# Altium schematic sheet Soft.SchDoc
size A4; SheetNumber: 4; SheetTotal: 4
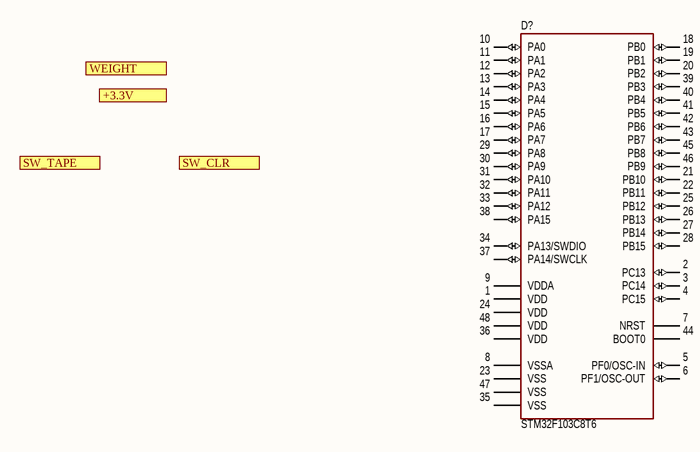
[diagram p0: Soft.SchDoc]

## Parts
D?  (no value)  [48-LQFP]

## Ports
+3.3V (out), SW_CLR (out), SW_TAPE (out), WEIGHT (out)

## Nets

Not connected (* = marked no-connect by the designer): D? 1(VDD) 2(PC13) 3(PC14) 4(PC15) 5(PF0/OSC-IN) 6(PF1/OSC-OUT) 7(NRST) 8(VSSA) 9(VDDA) 10(PA0) 11(PA1) 12(PA2) 13(PA3) 14(PA4) 15(PA5) 16(PA6) 17(PA7) 18(PB0) 19(PB1) 20(PB2) 21(PB10) 22(PB11) 23(VSS) 24(VDD) 25(PB12) 26(PB13) 27(PB14) 28(PB15) 29(PA8) 30(PA9) 31(PA10) 32(PA11) 33(PA12) 34(PA13/SWDIO) 35(VSS) 36(VDD) 37(PA14/SWCLK) 38(PA15) 39(PB3) 40(PB4) 41(PB5) 42(PB6) 43(PB7) 44(BOOT0) 45(PB8) 46(PB9) 47(VSS) 48(VDD)

## Library data of the parts
D? = STM32F103C8T6: Cortex-M0; Manufacturer: STMicroelectronics; ValueManufacturerPartNumber: IC microcontroller, 32-Bit, Cortex-M0, 48MHz, 64KB, 8KB, 2.4...3.6V, -40...+85°C, 48-LQFP; Supply: 2.4...3.6V; Speed: 48MHz; CoreSize: 32-Bit; MemoryROM: 64KB; MemoryRAM: 8KB; HelpURL: https://www.digikey.com/product-detail/en/stmicroelectronics/STM32F030C8T6/497-14043-ND/4357252; Package: 48-LQFP; ComponentType: IC microcontroller; Temperature: -40...+85°C; CoreProcessor: Cortex-M0; PartNumber: STM32F103C8T6